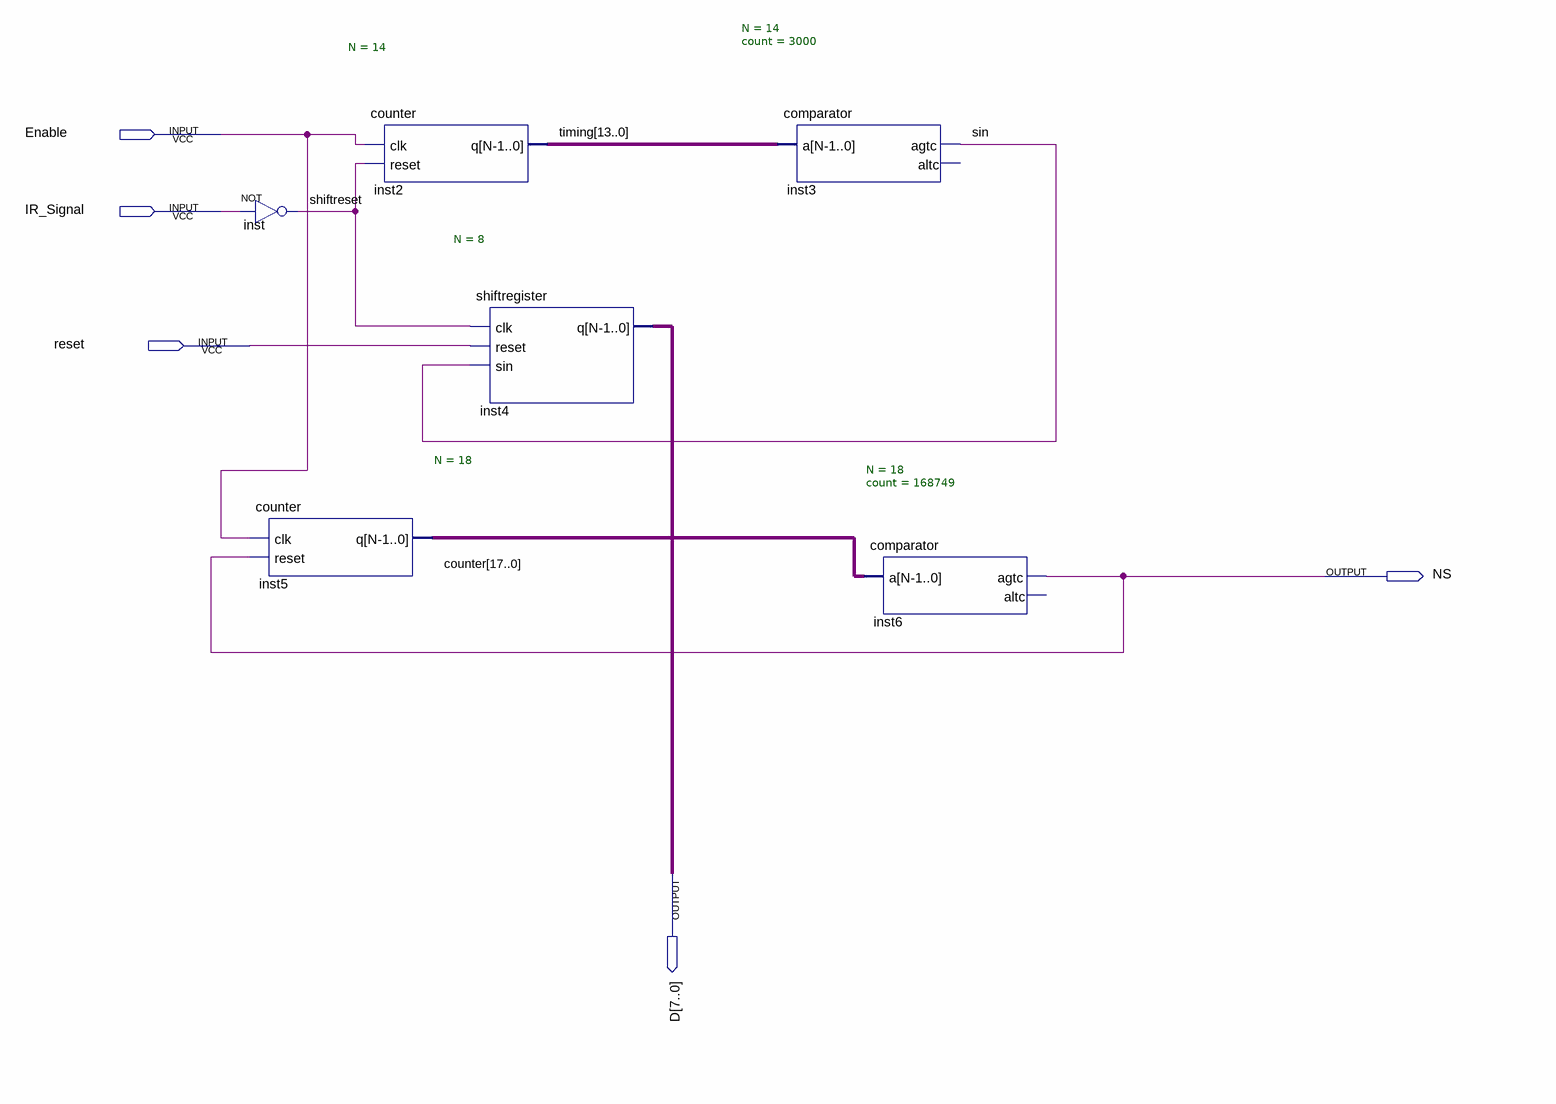
[diagram p0: schematic sheet]
// Quartus schematic shiftreg.bdf as structural Verilog: 6 symbols, 5 pins
module shiftreg (
  input  Enable,
  input  IR_Signal,
  input  reset,
  output NS,
  output [7:0] D
);

  wire shiftreset, sin;
  wire [13:0] timing;
  wire [17:0] counter;

  not inst (shiftreset, IR_Signal);
  counter #(.N(18)) inst5 (.clk(Enable), .reset(NS), .q(counter));
  counter #(.N(14)) inst2 (.clk(Enable), .reset(shiftreset), .q(timing));
  shiftregister #(.N(8)) inst4 (.clk(shiftreset), .reset(reset), .sin(sin), .q(D));
  comparator #(.N(14), .count(3000)) inst3 (.a(timing), .agtc(sin));  // open: altc
  comparator #(.N(18), .count(168749)) inst6 (.a(counter), .agtc(NS));  // open: altc
endmodule
